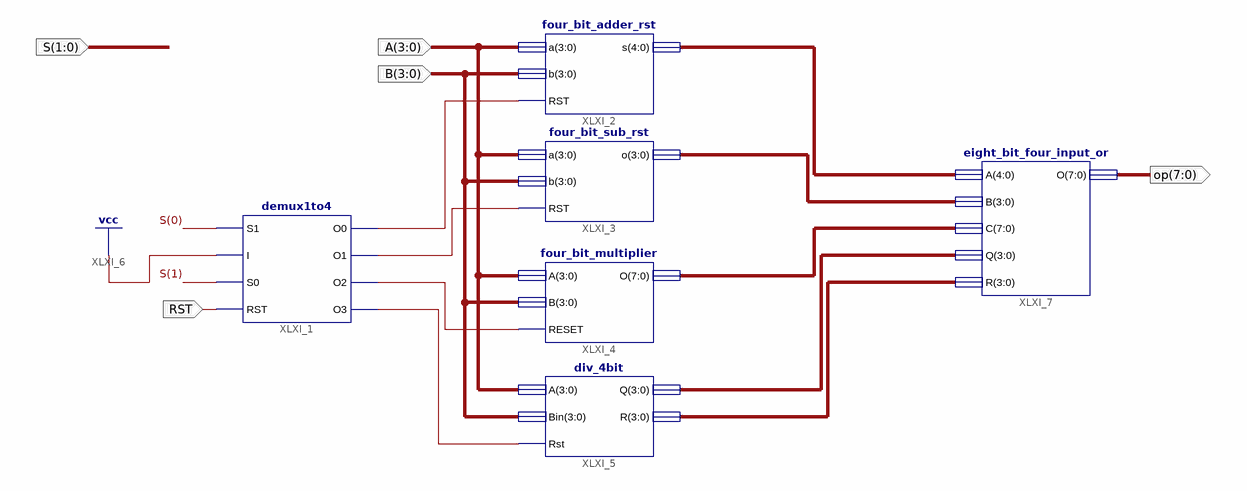
[diagram p0: schematic sheet 1]
// Xilinx ISE schematic final_4bit_unsigned_calc.sch (artix7) as structural Verilog: 6 symbols, 5 ports
module final_4bit_unsigned_calc (
  input  [1:0] S,
  input  RST,
  input  [3:0] A,
  input  [3:0] B,
  output [7:0] op
);

  wire XLXN_4, XLXN_5, XLXN_7, XLXN_8;
  wire [3:0] XLXN_10, XLXN_12, XLXN_13;
  wire [4:0] XLXN_9;
  wire [7:0] XLXN_11;

  demux1to4 XLXI_1 (.I(1'b1), .O0(XLXN_4), .O1(XLXN_5), .O2(XLXN_7), .O3(XLXN_8), .RST(RST), .S0(S[1]), .S1(S[0]));
  four_bit_adder_rst XLXI_2 (.a(A), .b(B), .RST(XLXN_4), .s(XLXN_9));
  four_bit_sub_rst XLXI_3 (.a(A), .b(B), .o(XLXN_10), .RST(XLXN_5));
  four_bit_multiplier XLXI_4 (.A(A), .B(B), .O(XLXN_11), .RESET(XLXN_7));
  div_4bit XLXI_5 (.A(A), .Bin(B), .Q(XLXN_12), .R(XLXN_13), .Rst(XLXN_8));
  eight_bit_four_input_or XLXI_7 (.A(XLXN_9), .B(XLXN_10), .C(XLXN_11), .O(op), .Q(XLXN_12), .R(XLXN_13));
endmodule
